# Altium schematic sheet rectifiers.SchDoc
size A3
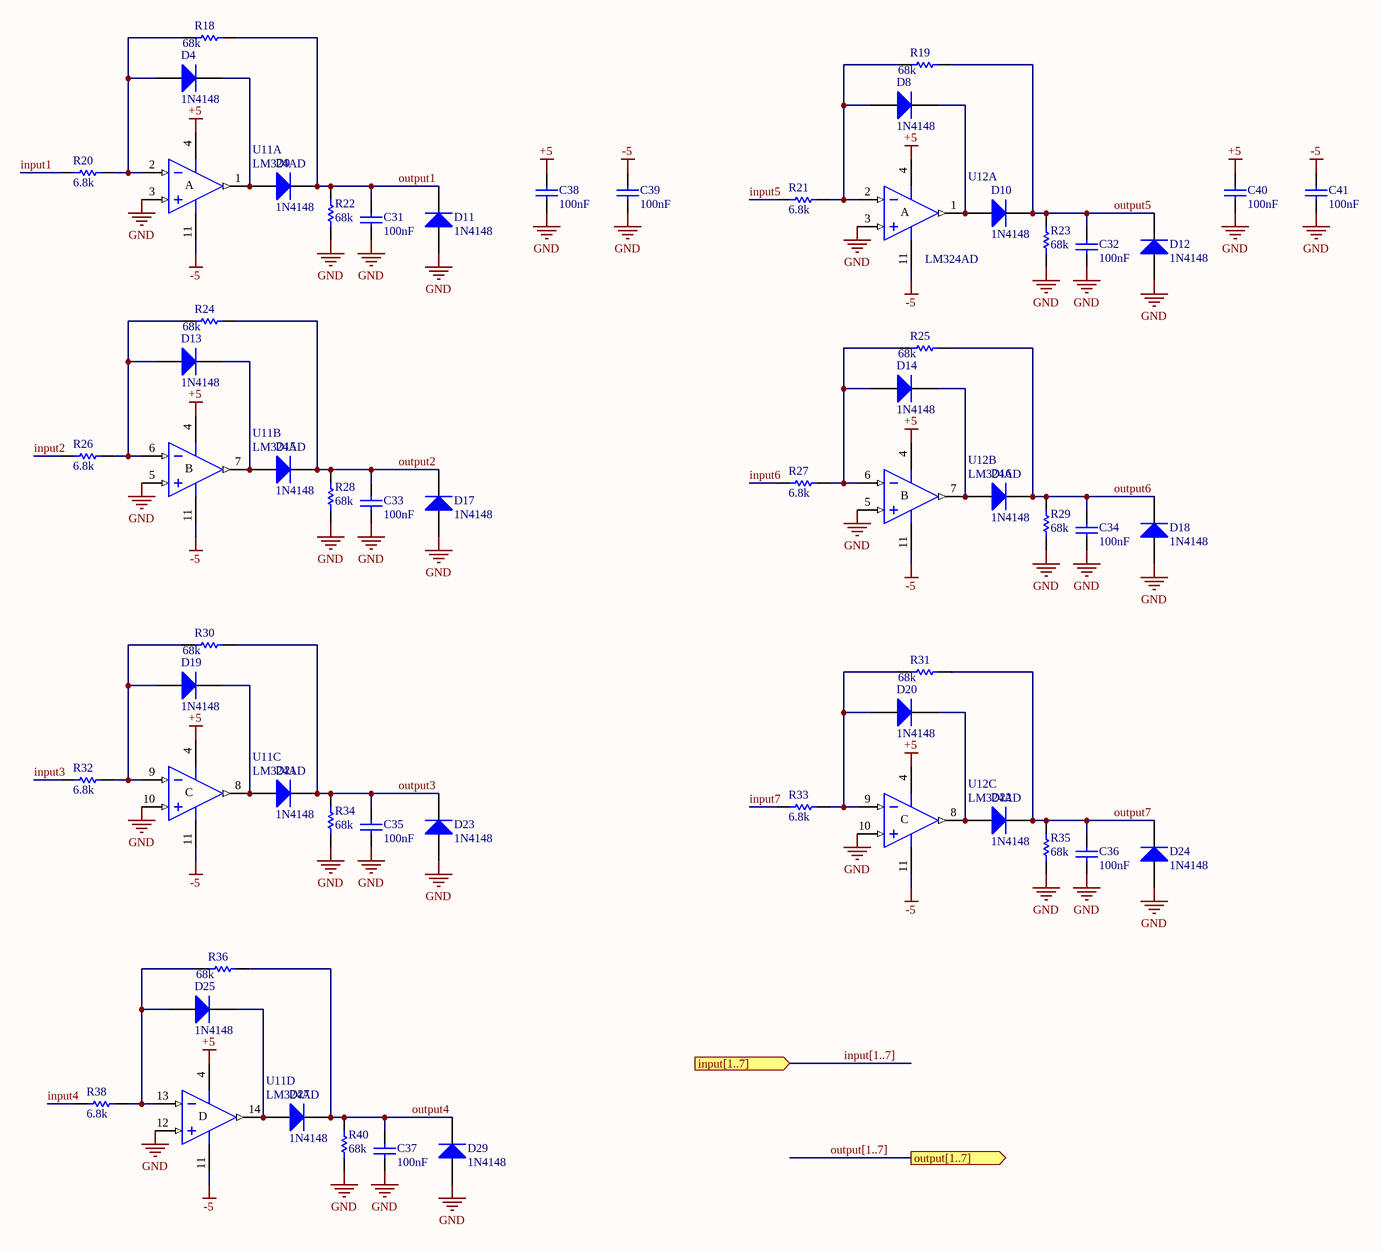
[diagram p0: rectifiers.SchDoc]

## Parts
C31  value 100nF  [SMD_CAP_0805]  (hidden comment: Cap)
C32  value 100nF  [SMD_CAP_0805]  (hidden comment: Cap)
C33  value 100nF  [SMD_CAP_0805]  (hidden comment: Cap)
C34  value 100nF  [SMD_CAP_0805]  (hidden comment: Cap)
C35  value 100nF  [SMD_CAP_0805]  (hidden comment: Cap)
C36  value 100nF  [SMD_CAP_0805]  (hidden comment: Cap)
C37  value 100nF  [SMD_CAP_0805]  (hidden comment: Cap)
C38  value 100nF  [SMD_CAP_0805]  (hidden comment: Cap)
C39  value 100nF  [SMD_CAP_0805]  (hidden comment: Cap)
C40  value 100nF  [SMD_CAP_0805]  (hidden comment: Cap)
C41  value 100nF  [SMD_CAP_0805]  (hidden comment: Cap)
D4  1N4148  [LL4148]
D8  1N4148  [LL4148]
D9  1N4148  [LL4148]
D10  1N4148  [LL4148]
D11  1N4148  [LL4148]
D12  1N4148  [LL4148]
D13  1N4148  [LL4148]
D14  1N4148  [LL4148]
D15  1N4148  [LL4148]
D16  1N4148  [LL4148]
D17  1N4148  [LL4148]
D18  1N4148  [LL4148]
D19  1N4148  [LL4148]
D20  1N4148  [LL4148]
D21  1N4148  [LL4148]
D22  1N4148  [LL4148]
D23  1N4148  [LL4148]
D24  1N4148  [LL4148]
D25  1N4148  [LL4148]
D27  1N4148  [LL4148]
D29  1N4148  [LL4148]
R18  value 68k  [RES 0805 (2012X06L)]  (hidden comment: Res1)
R19  value 68k  [RES 0805 (2012X06L)]  (hidden comment: Res1)
R20  value 6.8k  [RES 0805 (2012X06L)]  (hidden comment: Res1)
R21  value 6.8k  [RES 0805 (2012X06L)]  (hidden comment: Res1)
R22  value 68k  [RES 0805 (2012X06L)]  (hidden comment: Res1)
R23  value 68k  [RES 0805 (2012X06L)]  (hidden comment: Res1)
R24  value 68k  [RES 0805 (2012X06L)]  (hidden comment: Res1)
R25  value 68k  [RES 0805 (2012X06L)]  (hidden comment: Res1)
R26  value 6.8k  [RES 0805 (2012X06L)]  (hidden comment: Res1)
R27  value 6.8k  [RES 0805 (2012X06L)]  (hidden comment: Res1)
R28  value 68k  [RES 0805 (2012X06L)]  (hidden comment: Res1)
R29  value 68k  [RES 0805 (2012X06L)]  (hidden comment: Res1)
R30  value 68k  [RES 0805 (2012X06L)]  (hidden comment: Res1)
R31  value 68k  [RES 0805 (2012X06L)]  (hidden comment: Res1)
R32  value 6.8k  [RES 0805 (2012X06L)]  (hidden comment: Res1)
R33  value 6.8k  [RES 0805 (2012X06L)]  (hidden comment: Res1)
R34  value 68k  [RES 0805 (2012X06L)]  (hidden comment: Res1)
R35  value 68k  [RES 0805 (2012X06L)]  (hidden comment: Res1)
R36  value 68k  [RES 0805 (2012X06L)]  (hidden comment: Res1)
R38  value 6.8k  [RES 0805 (2012X06L)]  (hidden comment: Res1)
R40  value 68k  [RES 0805 (2012X06L)]  (hidden comment: Res1)
U11  LM324AD  [SO14_N]  (parts A,B,C,D of 4)
U12  LM324AD  [SO14_N]  (parts A,B,C of 4)

## Ports
input[1..7] (in), output[1..7] (out)

## Nets
+5: C38.2 C40.2 U11.4(V+) U12.4(V+)
-5: C39.2 C41.2 U11.11(V-) U12.11(V-)
GND: C31.1 C32.1 C33.1 C34.1 C35.1 C36.1 C37.1 C38.1 C39.1 C40.1 C41.1 D11.1(A) D12.1(A) D17.1(A) D18.1(A) D23.1(A) D24.1(A) D29.1(A) R22.1 R23.1 R28.1 R29.1 R34.1 R35.1 R40.1 U11.3(IN+) U11.5(IN+) U11.10(IN+) U11.12(IN+) U12.3(IN+) U12.5(IN+) U12.10(IN+)
input1: R20.1
input2: R26.1
input3: R32.1
input4: R38.1
input5: R21.1
input6: R27.1
input7: R33.1
output1: C31.2 D9.2(K) D11.2(K) R18.2 R22.2
output2: C33.2 D15.2(K) D17.2(K) R24.2 R28.2
output3: C35.2 D21.2(K) D23.2(K) R30.2 R34.2
output4: C37.2 D27.2(K) D29.2(K) R36.2 R40.2
output5: C32.2 D10.2(K) D12.2(K) R19.2 R23.2
output6: C34.2 D16.2(K) D18.2(K) R25.2 R29.2
output7: C36.2 D22.2(K) D24.2(K) R31.2 R35.2
NetD4_1: D4.1(A) R18.1 R20.2 U11.2(IN-)
NetD4_2: D4.2(K) D9.1(A) U11.1(OUT)
NetD8_1: D8.1(A) R19.1 R21.2 U12.2(IN-)
NetD8_2: D8.2(K) D10.1(A) U12.1(OUT)
NetD13_1: D13.1(A) R24.1 R26.2 U11.6(IN-)
NetD13_2: D13.2(K) D15.1(A) U11.7(OUT)
NetD14_1: D14.1(A) R25.1 R27.2 U12.6(IN-)
NetD14_2: D14.2(K) D16.1(A) U12.7(OUT)
NetD19_1: D19.1(A) R30.1 R32.2 U11.9(IN-)
NetD19_2: D19.2(K) D21.1(A) U11.8(OUT)
NetD20_1: D20.1(A) R31.1 R33.2 U12.9(IN-)
NetD20_2: D20.2(K) D22.1(A) U12.8(OUT)
NetD25_1: D25.1(A) R36.1 R38.2 U11.13(IN-)
NetD25_2: D25.2(K) D27.1(A) U11.14(OUT)

## Buses and harness runs
bus input[1..7] = port input[1..7]
bus output[1..7] = port output[1..7]

## Notes on the sheet
- (in symbol LM324AD, part A) A
- (in symbol LM324AD, part B) B
- (in symbol LM324AD, part C) C
- (in symbol LM324AD, part D) D

## Library data of the parts
C31-C41 = Cap ceramic: CAP-100Nf
D4 D8-D25 D27 D29 = Diode 1N4148: High Conductance Fast Diode; Published: 8-Jun-2000; LatestRevisionDate: 17-Jul-2002; LatestRevisionNote: Re-released for DXP Platform.; DatasheetVersion: 1997; PackageReference: DO-35; Publisher: Altium Limited; PackageDescription: Diode, Axial; Body 3.8 x 1.9 mm (LxDia. max), Lead Dia. 0.53 mm (max); Code_JEDEC: DO-204-AH; ComponentLink1Description: Manufacturer Link; ComponentLink1URL: http://www.fairchildsemi.com/; ComponentLink2Description: Datasheet; ComponentLink2URL: http://www.fairchildsemi.com/ds/1N%2F1N4148.pdf
R18-R36 R38 R40 = Res1: Resistor; Published: 8-Jun-2000; LatestRevisionDate: 17-Jul-2002; LatestRevisionNote: Re-released for DXP Platform.; PackageReference: AXIAL-0.3; Publisher: Altium Limited; PackageDescription: Axial Device, Thru-Hole; 2 Leads; 0.3 in Pin Spacing
U11 U12 = LM324AD: Low-Power Quad Operational Amplifier; Published: 24-Aug-2001; LatestRevisionDate: 13-Apr-2006; LatestRevisionNote: IPC-7351 Footprint Added.; DatasheetVersion: Nov-1997; PackageVersion: Sep-1998; PackageReference: SO14; Publisher: Altium Limited; PackageDescription: 14-Pin Small Outline Integrated Circuit 1.27 mm Pitch; Code_IPC: SOIC127P600-14; ComponentLink1Description: Manufacturer Link; ComponentLink1URL: http://www.st.com/; ComponentLink2Description: Datasheet; ComponentLink2URL: http://www.st.com/stonline/products/literature/ds/4797/lm224a.pdf